# EAGLE schematic emat_igbt_switch (EAGLE 9.2.2)
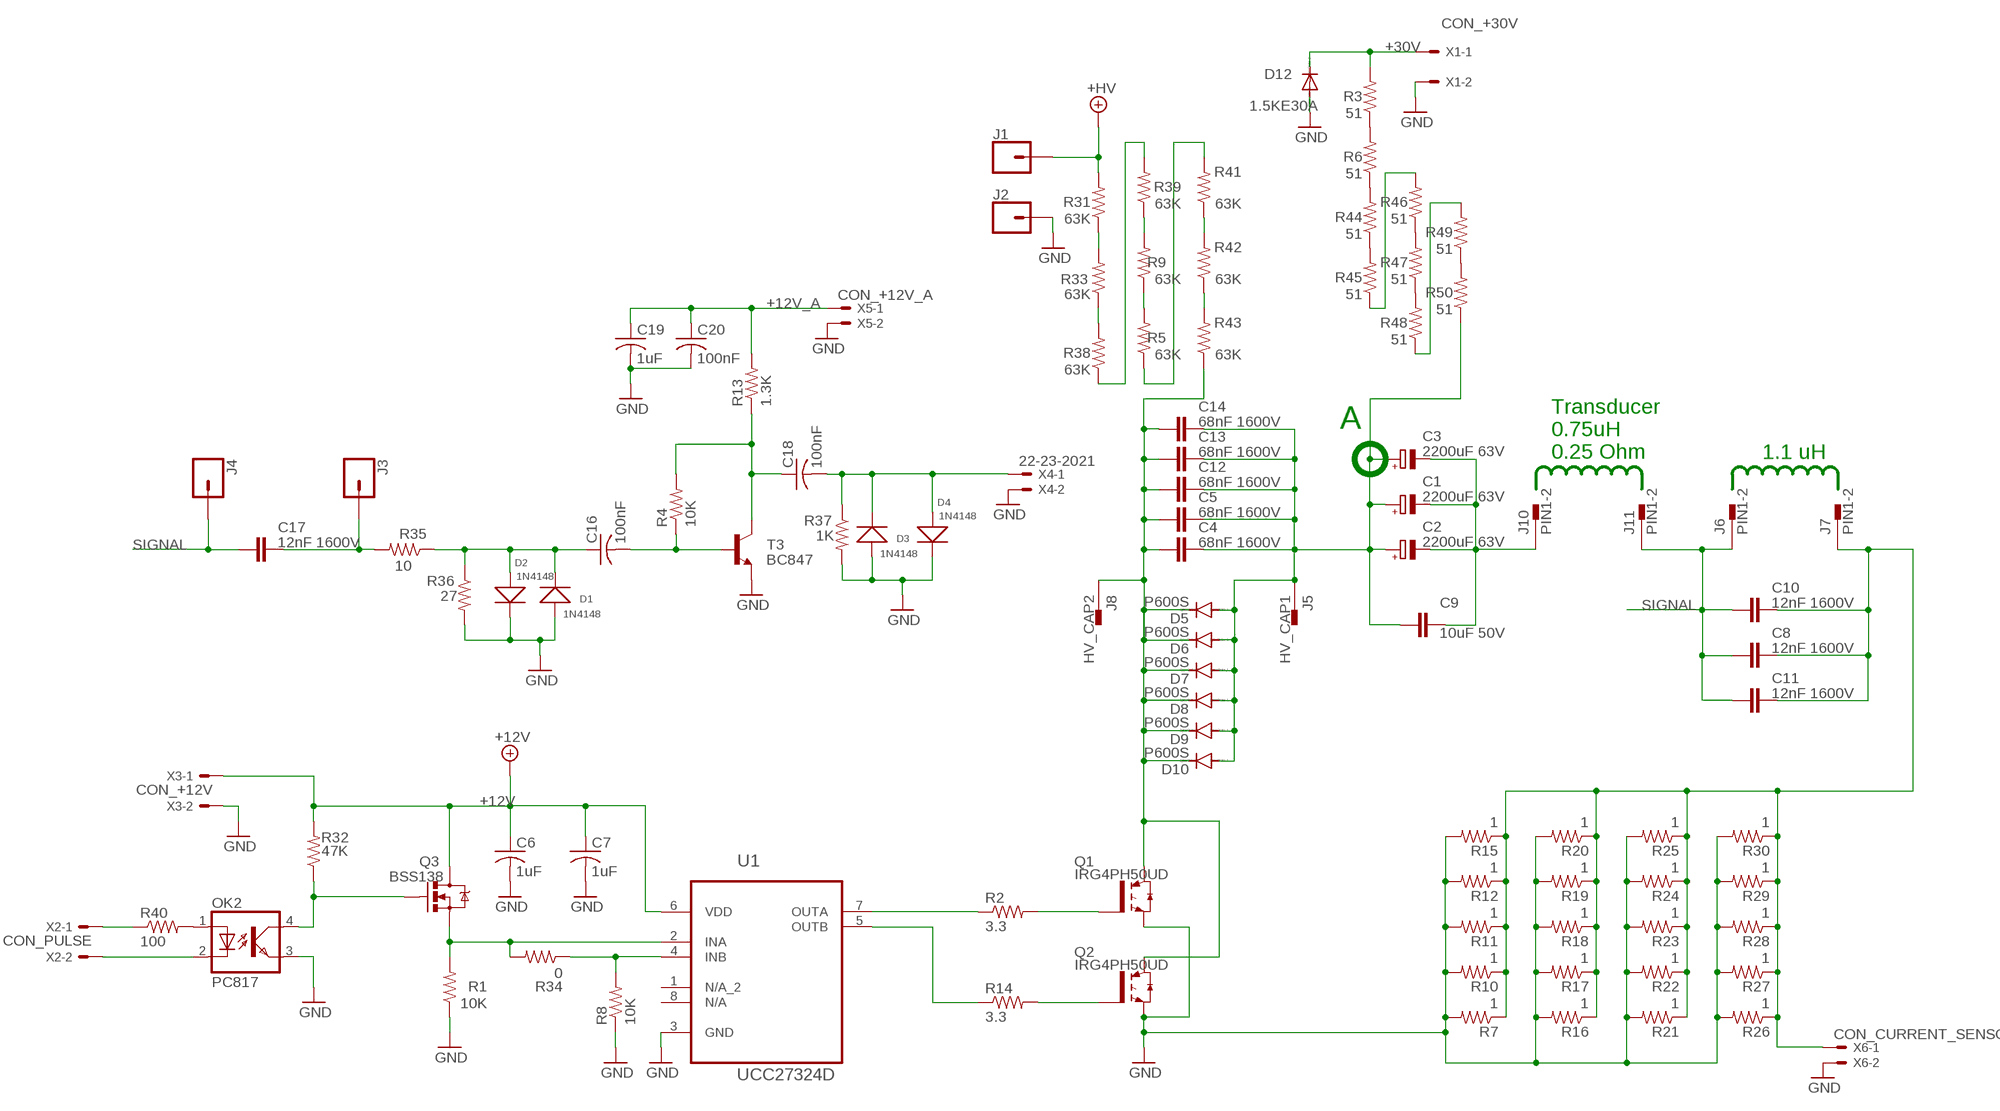
[diagram p0: schematic, sheet 1]

## Parts
C1  2200uF 63V  CPOL-EUE7.5-18  [E7,5-18]
C2  2200uF 63V  CPOL-EUE7.5-18  [E7,5-18]
C3  2200uF 63V  CPOL-EUE7.5-18  [E7,5-18]
C4  68nF 1600V  C37/15  [C37.5B15]
C5  68nF 1600V  C37/15  [C37.5B15]
C6  1uF  C-USC0805  [C0805]
C7  1uF  C-USC0805  [C0805]
C8  12nF 1600V  C22/10  [C22.5B10]
C9  10uF 50V  C-EUC2220K  [C2220K]
C10  12nF 1600V  C22/10  [C22.5B10]
C11  12nF 1600V  C22/10  [C22.5B10]
C12  68nF 1600V  C37/15  [C37.5B15]
C13  68nF 1600V  C37/15  [C37.5B15]
C14  68nF 1600V  C37/15  [C37.5B15]
C16  100nF  C-USC0805  [C0805]
C17  12nF 1600V  C22/10  [C22.5B10]
C18  100nF  C-USC0805  [C0805]
C19  1uF  C-USC0805  [C0805]
C20  100nF  C-USC0805  [C0805]
D1  1N4148  SMD-DIODE-SWITCH-1N4148(LL-34)  [LL-34]
D2  1N4148  SMD-DIODE-SWITCH-1N4148(LL-34)  [LL-34]
D3  1N4148  SMD-DIODE-SWITCH-1N4148(LL-34)  [LL-34]
D4  1N4148  SMD-DIODE-SWITCH-1N4148(LL-34)  [LL-34]
D5  P600S  P600  [P6-15]
D6  P600S  P600  [P6-15]
D7  P600S  P600  [P6-15]
D8  P600S  P600  [P6-15]
D9  P600S  P600  [P6-15]
D10  P600S  P600  [P6-15]
D12  1.5KE30A  DIODE-SMC  [SMC]
J1  CONN_01PTH_NO_SILK_KIT  [1X01NS_KIT]
J2  CONN_01PTH_NO_SILK_KIT  [1X01NS_KIT]
J3  CONN_01PTH_NO_SILK_KIT  [1X01NS_KIT]
J4  CONN_01PTH_NO_SILK_KIT  [1X01NS_KIT]
J5  HV_CAP1  PIN1-2  [62221]
J6  PIN1-2  [62221]
J7  PIN1-2  [62221]
J8  HV_CAP2  PIN1-2  [62221]
J10  PIN1-2  [62221]
J11  PIN1-2  [62221]
OK2  PC817  [DIL04]
Q1  IRG4PH50UD  IGBT_TO247  [TO247BV]
Q2  IRG4PH50UD  IGBT_TO247  [TO247BV]
Q3  BSS138  MOSFET-NCHANNELBSS138  [SOT23-3]
R1  10K  R-US_R1206  [R1206]
R2  3.3  R-US_R1206  [R1206]
R3  51  R-US_R1206  [R1206]
R4  10K  R-US_R1206  [R1206]
R5  63K  R-US_R1206  [R1206]
R6  51  R-US_R1206  [R1206]
R7  1  R-US_R1206  [R1206]
R8  10K  R-US_R1206  [R1206]
R9  63K  R-US_R1206  [R1206]
R10  1  R-US_R1206  [R1206]
R11  1  R-US_R1206  [R1206]
R12  1  R-US_R1206  [R1206]
R13  1.3K  R-US_R1206  [R1206]
R14  3.3  R-US_R1206  [R1206]
R15  1  R-US_R1206  [R1206]
R16  1  R-US_R1206  [R1206]
R17  1  R-US_R1206  [R1206]
R18  1  R-US_R1206  [R1206]
R19  1  R-US_R1206  [R1206]
R20  1  R-US_R1206  [R1206]
R21  1  R-US_R1206  [R1206]
R22  1  R-US_R1206  [R1206]
R23  1  R-US_R1206  [R1206]
R24  1  R-US_R1206  [R1206]
R25  1  R-US_R1206  [R1206]
R26  1  R-US_R1206  [R1206]
R27  1  R-US_R1206  [R1206]
R28  1  R-US_R1206  [R1206]
R29  1  R-US_R1206  [R1206]
R30  1  R-US_R1206  [R1206]
R31  63K  R-US_R1206  [R1206]
R32  47K  R-US_R1206  [R1206]
R33  63K  R-US_R1206  [R1206]
R34  0  R-US_R1206  [R1206]
R35  10  R-US_R1206  [R1206]
R36  27  R-US_R1206  [R1206]
R37  1K  R-US_R1206  [R1206]
R38  63K  R-US_R1206  [R1206]
R39  63K  R-US_R1206  [R1206]
R40  100  R-US_R1206  [R1206]
R41  63K  R-US_R1206  [R1206]
R42  63K  R-US_R1206  [R1206]
R43  63K  R-US_R1206  [R1206]
R44  51  R-US_R1206  [R1206]
R45  51  R-US_R1206  [R1206]
R46  51  R-US_R1206  [R1206]
R47  51  R-US_R1206  [R1206]
R48  51  R-US_R1206  [R1206]
R49  51  R-US_R1206  [R1206]
R50  51  R-US_R1206  [R1206]
T3  BC847  -NPN-SOT23-BEC  [SOT23-BEC]
U1  UCC27324D  [SOIC127P600X175-8N]
X1  CON_+30V  22-23-2021  [22-23-2021]
X2  CON_PULSE  22-23-2021  [22-23-2021]
X3  CON_+12V  22-23-2021  [22-23-2021]
X4  22-23-2021  [22-23-2021]
X5  CON_+12V_A  22-23-2021  [22-23-2021]
X6  CON_CURRENT_SENSOR  22-23-2021  [22-23-2021]

## Nets
+12V: C6.1 C7.1 Q3.3(D) R32.2 U1.6(VDD) X3.1
+12V_A: C19.1 C20.1 R13.2 X5.1
+30V: D12.C R3.2 X1.1
+HV: J1.1 R31.2
GND: C6.2 C7.2 C19.2 C20.2 D1.A(+) D2.C(-) D3.A(+) D4.C(-) D12.A J2.1 OK2.3(EMIT) Q1.S(E) Q2.S(E) R1.1 R7.2 R8.1 R10.2 R11.2 R12.2 R15.2 R16.2 R17.2 R18.2 R19.2 R20.2 R21.2 R22.2 R23.2 R24.2 R25.2 R26.2 R27.2 R28.2 R29.2 R30.2 R36.2 R37.2 T3.E U1.3(GND) X1.2 X3.2 X4.2 X5.2 X6.2
N$1: Q3.2(S) R1.2 R34.2 U1.2(INA)
N$2: R2.1 U1.7(OUTA)
N$3: Q1.G R2.2
N$4: R3.1 R6.2
N$5: C16.2 R4.1 T3.B
N$6: C18.1 R4.2 R13.1 T3.C
N$7: C8.2 C10.2 C11.2 J7.1 R7.1 R10.1 R11.1 R12.1 R15.1 R16.1 R17.1 R18.1 R19.1 R20.1 R21.1 R22.1 R23.1 R24.1 R25.1 R26.1 R27.1 R28.1 R29.1 R30.1 X6.1
N$8: C4.1 C5.1 C12.1 C13.1 C14.1 D5.C D6.C D7.C D8.C D9.C D10.C J8.1 Q1.D(C) Q2.D(C) R43.1
N$9: C1.+ C2.+ C3.+ C4.2 C5.2 C9.1 C12.2 C13.2 C14.2 D5.A D6.A D7.A D8.A D9.A D10.A J5.1 R50.1
N$10: Q2.G R14.2
N$11: R8.2 R34.1 U1.4(INB)
N$12: R14.1 U1.5(OUTB)
N$13: OK2.2(C) X2.2
N$15: R9.2 R39.1
N$17: OK2.4(COL) Q3.1(G) R32.1
N$18: R5.2 R9.1
N$22: C17.2 J3.1 R35.2
N$23: C1.- C2.- C3.- C9.2 J10.1
N$25: R33.1 R38.2
N$28: R31.1 R33.2
N$29: C16.1 D1.C(-) D2.A(+) R35.1 R36.1
N$30: C18.2 D3.C(-) D4.A(+) R37.1 X4.1
N$31: R40.1 X2.1
N$32: OK2.1(A) R40.2
N$33: R38.1 R39.2
N$34: R5.1 R41.2
N$35: R41.1 R42.2
N$36: R42.1 R43.2
N$37: R6.1 R44.2
N$38: R44.1 R45.2
N$39: R46.1 R47.2
N$40: R47.1 R48.2
N$41: R49.1 R50.2
N$42: R45.1 R46.2
N$43: R48.1 R49.2
SIGNAL: C8.1 C10.1 C11.1 C17.1 J4.1 J6.1 J11.1
Unconnected: U1.1(N/A_2) U1.8(N/A)

## Notes on the sheet
- A
- Transducer 
  0.75uH
  0.25 Ohm
- 1.1 uH

## Library data of the parts
C1-C3 = rcl:CPOL-EU: POLARIZED CAPACITOR, European symbol; SPICEPREFIX: C
C4 C5 C8 C10-C14 C17 = capacitor-wima:C: CAPACITOR naming: grid - package width
C6 C7 C16 C18-C20 = rcl:C-US: CAPACITOR, American symbol
C9 = rcl:C-EU: CAPACITOR, European symbol; SPICEPREFIX: C
D1-D4 = Seeed-Diode:SMD-DIODE-SWITCH-1N4148(LL-34): 304040016; MPN: 1N4148
D5 = diode:P600: DIODE high voltage diode, silicon rectifier 1.0 A to 6.0 A, 50 V to 1300 V http://www.kosemi.com/product/diosr.html; _EXTERNAL_: 1
D6-D10 = diode:P600: DIODE high voltage diode, silicon rectifier 1.0 A to 6.0 A, 50 V to 1300 V http://www.kosemi.com/product/diosr.html
D12 = diode:DIODE-: DIODE
J1-J4 = SparkFun-Connectors:CONN_01: Single connection point. Often used as Generic Header-pin footprint for 0.1 inch spaced/style header connections On any of the 0.1 inch spaced packages, you can populate with these: Break Away Headers - Straight <https://www.sparkfun.com/products/116> (PRT-00116) Break Away Male Headers - Right Angle <https://www.sparkfun.com/products/553> (PRT-00553) Female Headers <https://www.sparkfun.com/products/115> (PRT-00115) Break Away Headers - Machine Pin <https://www.sparkfun.com/products/117> (PRT-00117) Break Away Female Headers - Swiss Machine Pin <https://www.sparkfun.com/products/743> (PRT-00743) This device is also useful as a general connection point to wire up your design to another part of your project. Our various solder wires solder well into these plated through hole pads. Hook-Up Wire - Assortment (Stranded, 22 AWG) <https://www.sparkfun.com/products/11375> (PRT-11375) Hook-Up Wire - Assortment (Solid Core, 22 AWG) <https://www.sparkfun.com/products/11367> (PRT-11367) View the entire wire category on our website here <https://www.sparkfun.com/categories/141> Special notes: SMTSO-256-ET is a "flush mount" nut for a 4-40 screw. We mostly use this on specialty testbeds; it is a nice way to connect hardware to your PCB at an adjustable hieght. Also note, the SNAP packages are for using a snappable style connector. We sell a baggie of snaps and they are also used on two LilyPad designs: Snap Assortment - 30 pack (male and female) <https://www.sparkfun.com/products/11347> (DEV-11347) LilyPad Arduino SimpleSnap <https://www.sparkfun.com/products/10941> (DEV-10941) LilyPad SimpleSnap Protoboard <https://www.sparkfun.com/products/10940> (DEV-10940)
J5-J8 J10 J11 = con-faston:PIN1-2: CONN TAB FASTON BRASS .187 PCB TAB, FSSTON, DUAL STAKE, .187 SERIES Digi-Key Part Number: A24734CT-ND Source: Tyco Electronics Corporation .. ENG_CD_62221_R.pdf http://search.digikey.com/scripts/DkSearch/dksus.dll?Detail&name=A24734CT-ND; MF: TYCO ELECTRONICS; MPN: 62221-1; OC_FARNELL: unknown; OC_NEWARK: 16H2318
OK2 = optocoupler:PC817: SHARP OPTO COUPLER; MPN: PC817X4J000F; OC_FARNELL: 9707727; OC_NEWARK: 97K7059
Q1 Q2 = transistor-power:IGBT_TO247
Q3 = SparkFun-DiscreteSemi:MOSFET-NCHANNEL: Common NMOSFET Parts MFG P/N Store ID Prod ID FDD8780 TRANS-09984 SI7820DN TRANS-11055 FDS6630A IC-08089 2N7002PW TRANS-11151 FQP30N06L COM-10213 TRANS-10060 BSS123LT1G TRANS-08345 BSS138 TRANS-00830 BS170 2N7000; PROD_ID: TRANS-00830; VALUE: 200mA/50V
R1-R39 R41-R50 = rcl:R-US_: RESISTOR, American symbol
R40 = resistor:R-US_: RESISTOR, American symbol
T3 = DC_LOAD_AU:*-NPN-: NPN Transistror BF959 corrected 2008.03.06
U1 = UCC27324D:UCC27324D: DUAL 4-A PEAK HIGH SPEED LOW- SIDE POWER MOSFET DRIVERS
X1-X6 = con-molex:22-23-2021: .100" (2.54mm) Center Header - 2 Pin; MF: MOLEX; MPN: 22-23-2021; OC_FARNELL: 1462926; OC_NEWARK: 25C3832

## Net classes
0 default: width 0.3 mm, drill 0.3 mm, clearance 0.3 mm